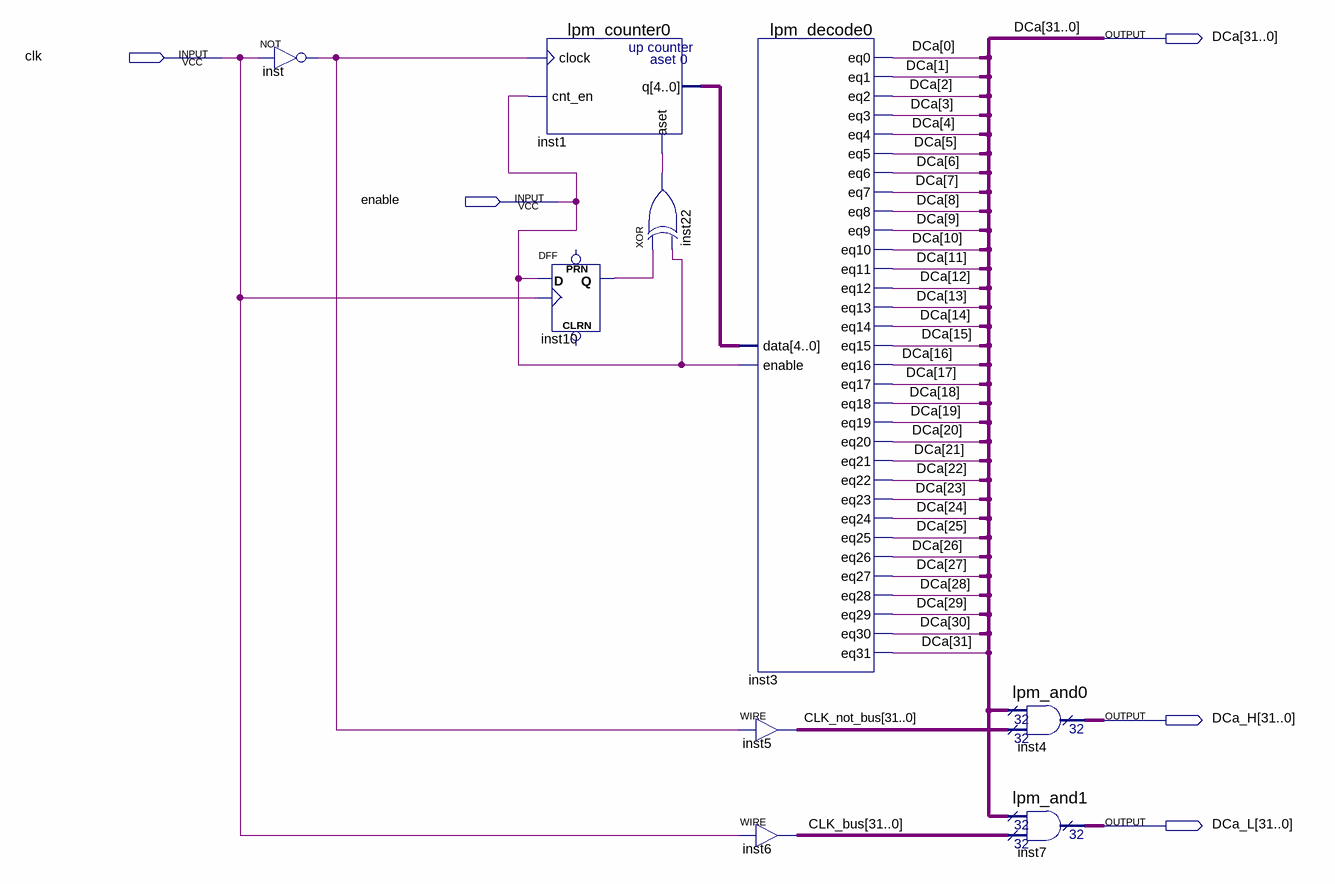
[diagram p0: schematic sheet]
// Quartus schematic CLK.bdf as structural Verilog: 9 symbols, 5 pins
module CLK (
  input  clk,
  input  enable,
  output [31:0] DCa,
  output [31:0] DCa_H,
  output [31:0] DCa_L
);

  wire inst10_q, inst22_out, inst_out;
  wire [4:0] inst1_q;
  wire [31:0] CLK_bus, CLK_not_bus;

  not inst (inst_out, clk);
  lpm_counter0 inst1 (.clock(inst_out), .cnt_en(enable), .aset(inst22_out), .q(inst1_q));
  DFF inst10 (.CLK(clk), .D(enable), .Q(inst10_q));  // open: CLRN, PRN
  xor inst22 (inst22_out, inst10_q, enable);
  lpm_decode0 inst3 (
    .data(inst1_q), .enable(enable), .eq0(DCa[0]), .eq1(DCa[1]), .eq2(DCa[2]), .eq3(DCa[3]), .eq4(DCa[4]),
    .eq5(DCa[5]), .eq6(DCa[6]), .eq7(DCa[7]), .eq8(DCa[8]), .eq9(DCa[9]), .eq10(DCa[10]), .eq11(DCa[11]),
    .eq12(DCa[12]), .eq13(DCa[13]), .eq14(DCa[14]), .eq15(DCa[15]), .eq16(DCa[16]), .eq17(DCa[17]),
    .eq18(DCa[18]), .eq19(DCa[19]), .eq20(DCa[20]), .eq21(DCa[21]), .eq22(DCa[22]), .eq23(DCa[23]),
    .eq24(DCa[24]), .eq25(DCa[25]), .eq26(DCa[26]), .eq27(DCa[27]), .eq28(DCa[28]), .eq29(DCa[29]),
    .eq30(DCa[30]), .eq31(DCa[31]));
  assign CLK_not_bus = {32{inst_out}};  // WIRE inst5
  assign CLK_bus = {32{clk}};  // WIRE inst6
  lpm_and0 inst4 (.data0x(DCa), .data1x(CLK_not_bus), .result(DCa_H));
  lpm_and1 inst7 (.data0x(DCa), .data1x(CLK_bus), .result(DCa_L));
endmodule
